# EAGLE design tinyfoc_triple (EAGLE 9.6.2)
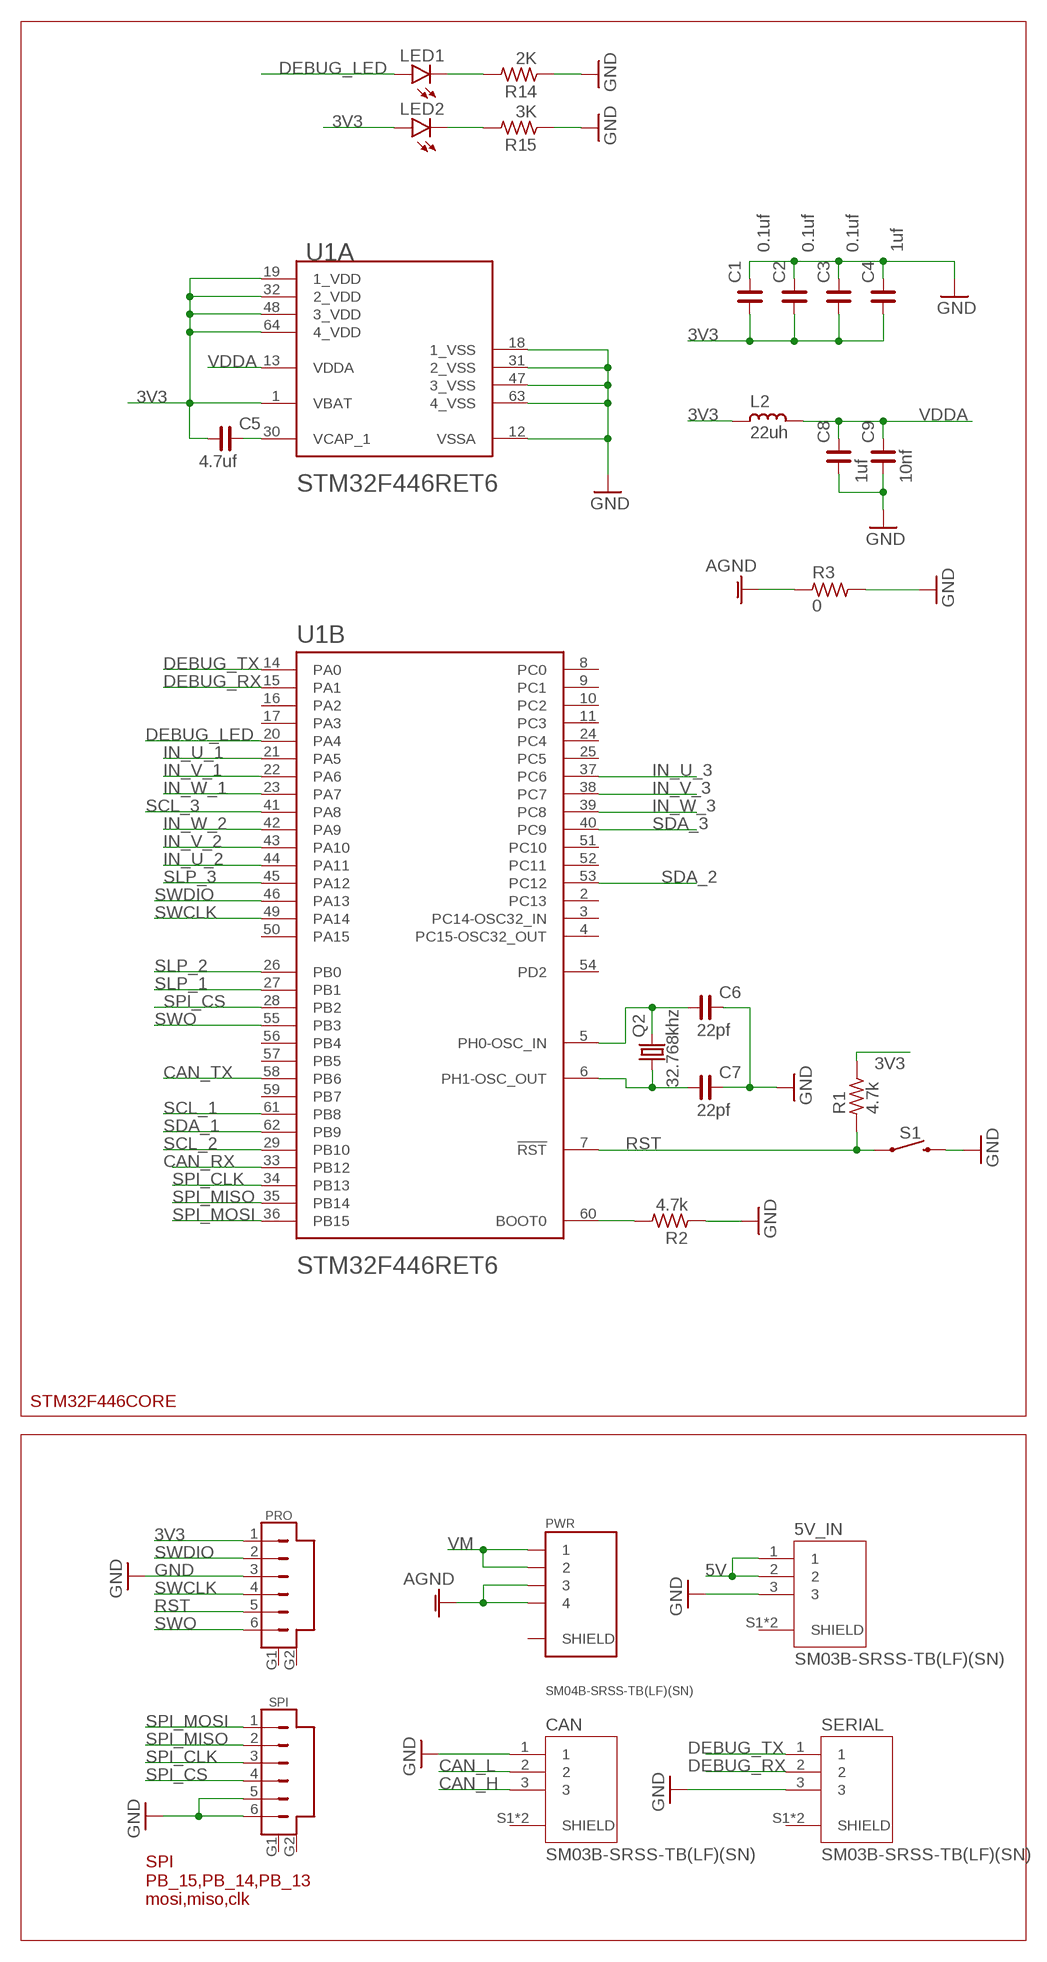
[diagram p0: schematic, sheet 1, part 1 of 2]
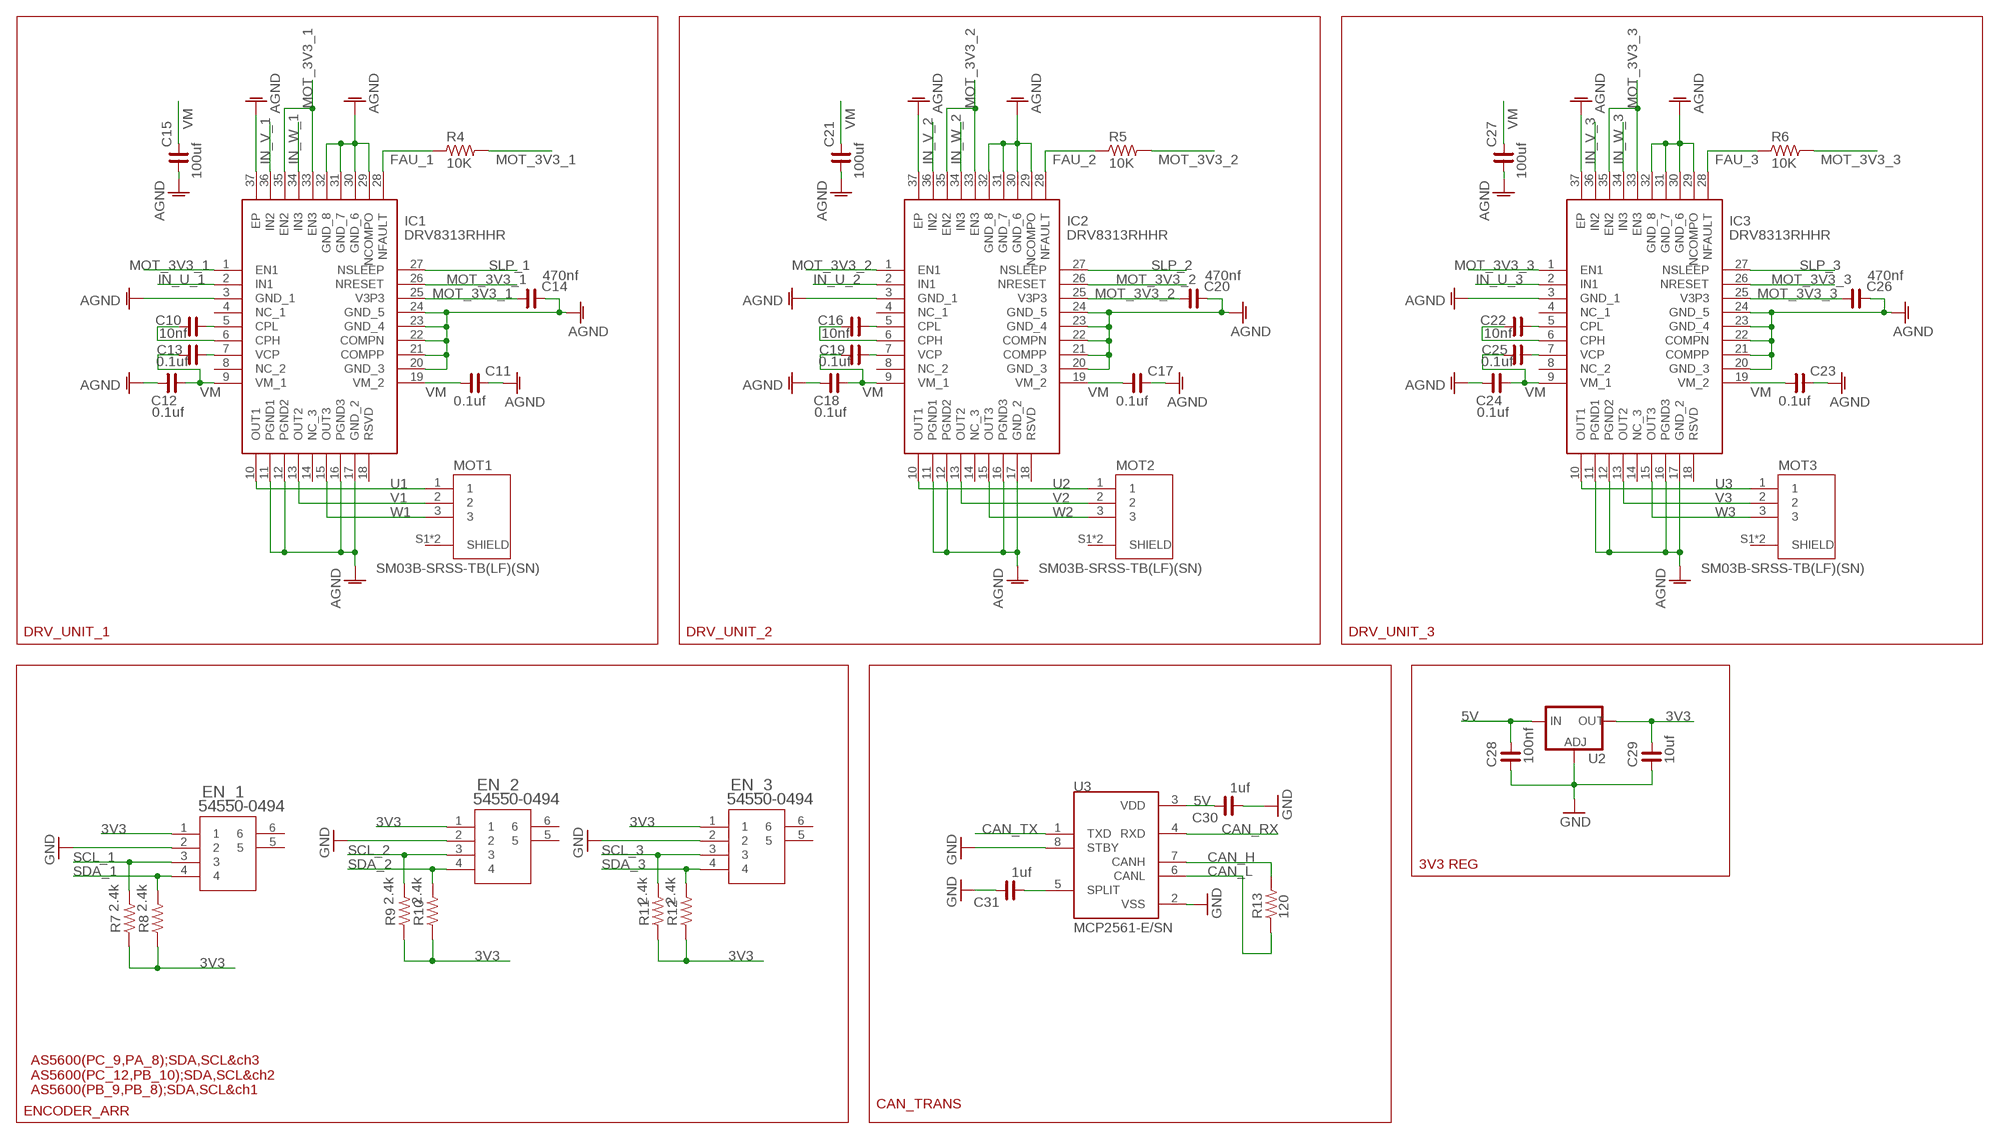
[diagram p1: schematic, sheet 1, part 2 of 2]

## Parts
5V_IN  SM03B-SRSS-TB(LF)(SN)  [JST_SM03B-SRSS-TB(LF)(SN)]
C1  0.1uf  C_0603  [C0603]
C2  0.1uf  C_0603  [C0603]
C3  0.1uf  C_0603  [C0603]
C4  1uf  C_0603  [C0603]
C5  4.7uf  C_1206  [C1206]
C6  22pf  C_0603  [C0603]
C7  22pf  C_0603  [C0603]
C8  1uf  C_0603  [C0603]
C9  10nf  C_0603  [C0603]
C10  10nf  C_0603  [C0603]
C11  0.1uf  C_0603  [C0603]
C12  0.1uf  C_0603  [C0603]
C13  0.1uf  C_0603  [C0603]
C14  470nf  C_0603  [C0603]
C15  100uf  C_1206  [C1206]
C16  10nf  C_0603  [C0603]
C17  0.1uf  C_0603  [C0603]
C18  0.1uf  C_0603  [C0603]
C19  0.1uf  C_0603  [C0603]
C20  470nf  C_0603  [C0603]
C21  100uf  C_1206  [C1206]
C22  10nf  C_0603  [C0603]
C23  0.1uf  C_0603  [C0603]
C24  0.1uf  C_0603  [C0603]
C25  0.1uf  C_0603  [C0603]
C26  470nf  C_0603  [C0603]
C27  100uf  C_1206  [C1206]
C28  100nf  C_0603  [C0603]
C29  10uf  C_0603  [C0603]
C30  1uf  C_0603  [C0603]
C31  1uf  C_0603  [C0603]
CAN  SM03B-SRSS-TB(LF)(SN)  [JST_SM03B-SRSS-TB(LF)(SN)]
EN_1  54550-0494  [CON4_1X4_DRB2_MOL]
EN_2  54550-0494  [CON4_1X4_DRB2_MOL]
EN_3  54550-0494  [CON4_1X4_DRB2_MOL]
IC1  DRV8313RHHR  [QFN50P600X600X100-37N]
IC2  DRV8313RHHR  [QFN50P600X600X100-37N]
IC3  DRV8313RHHR  [QFN50P600X600X100-37N]
L2  22uh  L_PM0603  [PM0603]
LED1  LEDCHIPLED_0603  [CHIPLED_0603]
LED2  LEDCHIPLED_0603  [CHIPLED_0603]
MOT1  SM03B-SRSS-TB(LF)(SN)  [JST_SM03B-SRSS-TB(LF)(SN)]
MOT2  SM03B-SRSS-TB(LF)(SN)  [JST_SM03B-SRSS-TB(LF)(SN)]
MOT3  SM03B-SRSS-TB(LF)(SN)  [JST_SM03B-SRSS-TB(LF)(SN)]
PRO  SM06B-SRSS-TB  [SM06B]
PWR  SM04B-SRSS-TB(LF)(SN)  [JST_SM04B-SRSS-TB(LF)(SN)]
Q2  32.768khz  KX-327-NHF  [3.2X1.5]
R1  4.7k  R_0603  [R0603]
R2  4.7k  R_0603  [R0603]
R3  0  R_0603  [R0603]
R4  10K  R_0603  [R0603]
R5  10K  R_0603  [R0603]
R6  10K  R_0603  [R0603]
R7  2.4k  R_0603  [R0603]
R8  2.4k  R_0603  [R0603]
R9  2.4k  R_0603  [R0603]
R10  2.4k  R_0603  [R0603]
R11  2.4k  R_0603  [R0603]
R12  2.4k  R_0603  [R0603]
R13  120  R_0603  [R0603]
R14  2K  R_0603  [R0603]
R15  3K  R_0603  [R0603]
S1  MOMENTARY-SWITCH-SPST-SMD-RIGHT-ANGLE  [TACTILE_SWITCH_SMD_RIGHT_ANGLE]
SERIAL  SM03B-SRSS-TB(LF)(SN)  [JST_SM03B-SRSS-TB(LF)(SN)]
SPI  SM06B-SRSS-TB  [SM06B]
U1  STMICROELECTRONICS_STM32F446RET6STMICROELECTRONICS_STM32F446RET6_0_0  [STMICROELECTRONICS_STM32F446RET6_0]
U2  V_REG_LM1117SOT223  [SOT223]
U3  MCP2561-E/SN  [SOIC127P600X175-8N]

## Nets
3V3: C1.1 C2.1 C3.1 C4.1 C5.1 C29.2 EN_1.1 EN_2.1 EN_3.1 L2.2 LED2.A PRO.1 R1.2 R7.1 R8.1 R9.1 R10.1 R11.1 R12.1 U1.1(A:VBAT) U1.19(A:1_VDD) U1.32(A:2_VDD) U1.48(A:3_VDD) U1.64(A:4_VDD) U2.2(OUT) U2.4(OUT)
5V: 5V_IN.1 5V_IN.2 C28.2 C30.2 U2.3(IN) U3.3(VDD)
AGND: C11.2 C12.1 C14.2 C15.1 C17.2 C18.1 C20.2 C21.1 C23.2 C24.1 C26.2 C27.1 IC1.3(GND_1) IC1.11(PGND1) IC1.12(PGND2) IC1.16(PGND3) IC1.17(GND_2) IC1.20(GND_3) IC1.21(COMPP) IC1.22(COMPN) IC1.23(GND_4) IC1.24(GND_5) IC1.29(NCOMPO) IC1.30(GND_6) IC1.31(GND_7) IC1.32(GND_8) IC1.37(EP) IC2.3(GND_1) IC2.11(PGND1) IC2.12(PGND2) IC2.16(PGND3) IC2.17(GND_2) IC2.20(GND_3) IC2.21(COMPP) IC2.22(COMPN) IC2.23(GND_4) IC2.24(GND_5) IC2.29(NCOMPO) IC2.30(GND_6) IC2.31(GND_7) IC2.32(GND_8) IC2.37(EP) IC3.3(GND_1) IC3.11(PGND1) IC3.12(PGND2) IC3.16(PGND3) IC3.17(GND_2) IC3.20(GND_3) IC3.21(COMPP) IC3.22(COMPN) IC3.23(GND_4) IC3.24(GND_5) IC3.29(NCOMPO) IC3.30(GND_6) IC3.31(GND_7) IC3.32(GND_8) IC3.37(EP) PWR.3 PWR.4 R3.1
CAN_H: CAN.3 R13.2 U3.7(CANH)
CAN_L: CAN.2 R13.1 U3.6(CANL)
CAN_RX: U1.33(B:PB12) U3.4(RXD)
CAN_TX: U1.58(B:PB6) U3.1(TXD)
DEBUG_LED: LED1.A U1.20(B:PA4)
DEBUG_RX: SERIAL.2 U1.15(B:PA1)
DEBUG_TX: SERIAL.1 U1.14(B:PA0)
FAU_1: IC1.28(NFAULT) R4.1
FAU_2: IC2.28(NFAULT) R5.1
FAU_3: IC3.28(NFAULT) R6.1
GND: 5V_IN.3 C1.2 C2.2 C3.2 C4.2 C6.2 C7.2 C8.1 C9.1 C28.1 C29.1 C30.1 C31.2 CAN.1 EN_1.2 EN_2.2 EN_3.2 PRO.3 R2.1 R3.2 R14.1 R15.1 S1.2 SERIAL.3 SPI.5 SPI.6 U1.12(A:VSSA) U1.18(A:1_VSS) U1.31(A:2_VSS) U1.47(A:3_VSS) U1.63(A:4_VSS) U2.1(ADJ) U3.2(VSS) U3.8(STBY)
IN_U_1: IC1.2(IN1) U1.21(B:PA5)
IN_U_2: IC2.2(IN1) U1.44(B:PA11)
IN_U_3: IC3.2(IN1) U1.37(B:PC6)
IN_V_1: IC1.36(IN2) U1.22(B:PA6)
IN_V_2: IC2.36(IN2) U1.43(B:PA10)
IN_V_3: IC3.36(IN2) U1.38(B:PC7)
IN_W_1: IC1.34(IN3) U1.23(B:PA7)
IN_W_2: IC2.34(IN3) U1.42(B:PA9)
IN_W_3: IC3.34(IN3) U1.39(B:PC8)
MOT_3V3_1: C14.1 IC1.1(EN1) IC1.25(V3P3) IC1.26(NRESET) IC1.33(EN3) IC1.35(EN2) R4.2
MOT_3V3_2: C20.1 IC2.1(EN1) IC2.25(V3P3) IC2.26(NRESET) IC2.33(EN3) IC2.35(EN2) R5.2
MOT_3V3_3: C26.1 IC3.1(EN1) IC3.25(V3P3) IC3.26(NRESET) IC3.33(EN3) IC3.35(EN2) R6.2
N$1: C5.2 U1.30(A:VCAP_1)
N$2: R2.2 U1.60(B:BOOT0)
N$3: C7.1 Q2.1 U1.6(B:PH1-OSC_OUT)
N$4: C10.2 IC1.5(CPL)
N$5: C6.1 Q2.2 U1.5(B:PH0-OSC_IN)
N$6: C10.1 IC1.6(CPH)
N$7: C13.2 IC1.7(VCP)
N$8: C16.2 IC2.5(CPL)
N$9: C16.1 IC2.6(CPH)
N$10: C19.2 IC2.7(VCP)
N$11: C22.2 IC3.5(CPL)
N$12: C22.1 IC3.6(CPH)
N$13: C25.2 IC3.7(VCP)
N$14: C31.1 U3.5(SPLIT)
N$15: LED2.C R15.2
N$16: LED1.C R14.2
RST: PRO.5 R1.1 S1.1 U1.7(B:!RST!)
SCL_1: EN_1.3 R7.2 U1.61(B:PB8)
SCL_2: EN_2.3 R9.2 U1.29(B:PB10)
SCL_3: EN_3.3 R11.2 U1.41(B:PA8)
SDA_1: EN_1.4 R8.2 U1.62(B:PB9)
SDA_2: EN_2.4 R10.2 U1.53(B:PC12)
SDA_3: EN_3.4 R12.2 U1.40(B:PC9)
SLP_1: IC1.27(NSLEEP) U1.27(B:PB1)
SLP_2: IC2.27(NSLEEP) U1.26(B:PB0)
SLP_3: IC3.27(NSLEEP) U1.45(B:PA12)
SPI_CLK: SPI.3 U1.34(B:PB13)
SPI_CS: SPI.4 U1.28(B:PB2)
SPI_MISO: SPI.2 U1.35(B:PB14)
SPI_MOSI: SPI.1 U1.36(B:PB15)
SWCLK: PRO.4 U1.49(B:PA14)
SWDIO: PRO.2 U1.46(B:PA13)
SWO: PRO.6 U1.55(B:PB3)
U1: IC1.10(OUT1) MOT1.1
U2: IC2.10(OUT1) MOT2.1
U3: IC3.10(OUT1) MOT3.1
V1: IC1.13(OUT2) MOT1.2
V2: IC2.13(OUT2) MOT2.2
V3: IC3.13(OUT2) MOT3.2
VDDA: C8.2 C9.2 L2.1 U1.13(A:VDDA)
VM: C11.1 C12.2 C13.1 C15.2 C17.1 C18.2 C19.1 C21.2 C23.1 C24.2 C25.1 C27.2 IC1.9(VM_1) IC1.19(VM_2) IC2.9(VM_1) IC2.19(VM_2) IC3.9(VM_1) IC3.19(VM_2) PWR.1 PWR.2
W1: IC1.15(OUT3) MOT1.3
W2: IC2.15(OUT3) MOT2.3
W3: IC3.15(OUT3) MOT3.3
Unconnected: 5V_IN.S1(SHIELD) 5V_IN.S2(SHIELD) CAN.S1(SHIELD) CAN.S2(SHIELD) EN_1.5 EN_1.6 EN_2.5 EN_2.6 EN_3.5 EN_3.6 IC1.4(NC_1) IC1.8(NC_2) IC1.14(NC_3) IC1.18(RSVD) IC2.4(NC_1) IC2.8(NC_2) IC2.14(NC_3) IC2.18(RSVD) IC3.4(NC_1) IC3.8(NC_2) IC3.14(NC_3) IC3.18(RSVD) MOT1.S1(SHIELD) MOT1.S2(SHIELD) MOT2.S1(SHIELD) MOT2.S2(SHIELD) MOT3.S1(SHIELD) MOT3.S2(SHIELD) PRO.G1 PRO.G2 PWR.S1(SHIELD) PWR.S2(SHIELD) SERIAL.S1(SHIELD) SERIAL.S2(SHIELD) SPI.G1 SPI.G2 U1.2(B:PC13) U1.3(B:PC14-OSC32_IN) U1.4(B:PC15-OSC32_OUT) U1.8(B:PC0) U1.9(B:PC1) U1.10(B:PC2) U1.11(B:PC3) U1.16(B:PA2) U1.17(B:PA3) U1.24(B:PC4) U1.25(B:PC5) U1.50(B:PA15) U1.51(B:PC10) U1.52(B:PC11) U1.54(B:PD2) U1.56(B:PB4) U1.57(B:PB5) U1.59(B:PB7)

## Notes on the sheet
- DRV_UNIT_1 | DRV_UNIT_2 | DRV_UNIT_3
- 3V3 REG
- AS5600(PC_9,PA_8);SDA,SCL&ch3
  AS5600(PC_12,PB_10);SDA,SCL&ch2
  AS5600(PB_9,PB_8);SDA,SCL&ch1
- CAN_TRANS
- STM32F446CORE | ENCODER_ARR
- SPI 
  PB_15,PB_14,PB_13
  mosi,miso,clk

## Library data of the parts
5V_IN CAN MOT1-MOT3 SERIAL = SM03B-SRSS-TB_LF__SN_:SM03B-SRSS-TB(LF)(SN): SH Series 3 Position 1 mm Pitch Surface Mount Side Entry Shrouded Header; AVAILABILITY: Unavailable; DESCRIPTION: Connector Header Surface Mount, Right Angle 3 position 0.039 _1.00mm_; MF: JST Sales; MP: SM03B-SRSS-TB_LF__SN_; PACKAGE: None; PRICE: None
C1-C31 = rc-master-smd:C_: NON-POLARIZED CAP
EN_1-EN_3 = fpc_4p_0.5:54550-0494; BUILT_BY: EMA_UL_Team; MANUFACTURER_PART_NUMBER: 54550-0494; SOURCELIBRARY: Molex_2010-01-01; VENDOR: Molex Connector Corporation
IC1-IC3 = DRV8313RHHR:DRV8313RHHR: TEXAS INSTRUMENTS - DRV8313RHHR - MOTOR DRIVER, 3P BLDC, 1.75A, VQFN-36 Source: Datasheet <http://www.ti.com/lit/ds/symlink/drv8313.pdf>; ARROW_PART_NUMBER: DRV8313RHHR; ARROW_PRICE-STOCK: https://www.arrow.com/en/products/drv8313rhhr/texas-instruments; DESCRIPTION: TEXAS INSTRUMENTS - DRV8313RHHR - MOTOR DRIVER, 3P BLDC, 1.75A, VQFN-36; HEIGHT: 1mm; MANUFACTURER_NAME: Texas Instruments; MANUFACTURER_PART_NUMBER: DRV8313RHHR; MOUSER_PART_NUMBER: 595-DRV8313RHHR; MOUSER_PRICE-STOCK: https://www.mouser.co.uk/ProductDetail/Texas-Instruments/DRV8313RHHR?qs=VymPLiRQZIS1rnepRn1%252BBA%3D%3D
L2 = rc-master-smd:L_: INDUCTOR
LED1 LED2 = led:LED: LED OSRAM: - CHIPLED LG R971, LG N971, LY N971, LG Q971, LY Q971, LO R971, LY R971 LH N974, LH R974 LS Q976, LO Q976, LY Q976 LO Q996 - Hyper CHIPLED LW Q18S LB Q993, LB Q99A, LB R99A - SideLED LS A670, LO A670, LY A670, LG A670, LP A670 LB A673, LV A673, LT A673, LW A673 LH A674 LY A675 LS A676, LA A676, LO A676, LY A676, LW A676 LS A679, LY A679, LG A679 - Hyper Micro SIDELED® LS Y876, LA Y876, LO Y876, LY Y876 LT Y87S - SmartLED LW L88C, LW L88S LB L89C, LB L89S, LG L890 LS L89K, LO L89K, LY L89K LS L896, LA L896, LO L896, LY L896 - TOPLED LS T670, LO T670, LY T670, LG T670, LP T670 LSG T670, LSP T670, LSY T670, LOP T670, LYG T670 LG T671, LOG T671, LSG T671 LB T673, LV T673, LT T673, LW T673 LH T674 LS T676, LA T676, LO T676, LY T676, LB T676, LH T676, LSB T676, LW T676 LB T67C, LV T67C, LT T67C, LS T67K, LO T67K, LY T67K, LW E67C LS E67B, LA E67B, LO E67B, LY E67B, LB E67C, LV E67C, LT E67C LW T67C LS T679, LY T679, LG T679 LS T770, LO T770, LY T770, LG T770, LP T770 LB T773, LV T773, LT T773, LW T773 LH T774 LS E675, LA E675, LY E675, LS T675 LS T776, LA T776, LO T776, LY T776, LB T776 LHGB T686 LT T68C, LB T68C - Hyper Mini TOPLED® LB M676 - Mini TOPLED Santana® LG M470 LS M47K, LO M47K, LY M47K Source: http://www.osram.convergy.de LUXEON: - LUMILED® LXK2-PW12-R00, LXK2-PW12-S00, LXK2-PW14-U00, LXK2-PW14-V00 LXK2-PM12-R00, LXK2-PM12-S00, LXK2-PM14-U00 LXK2-PE12-Q00, LXK2-PE12-R00, LXK2-PE12-S00, LXK2-PE14-T00, LXK2-PE14-U00 LXK2-PB12-K00, LXK2-PB12-L00, LXK2-PB12-M00, LXK2-PB14-N00, LXK2-PB14-P00, LXK2-PB14-Q00 LXK2-PR12-L00, LXK2-PR12-M00, LXK2-PR14-Q00, LXK2-PR14-R00 LXK2-PD12-Q00, LXK2-PD12-R00, LXK2-PD12-S00 LXK2-PH12-R00, LXK2-PH12-S00 LXK2-PL12-P00, LXK2-PL12-Q00, LXK2-PL12-R00 Source: www.luxeon.com KINGBRIGHT: KA-3528ASYC Source: www.kingbright.com
PRO SPI = SM06B-SRSS-TB:SM06B-SRSS-TB: CONN HEADER SH 6POS SIDE 1MM TIN Check prices <https://snapeda.com/parts/SM06B-SRSS-TB/JST%20Sales/view-part/?ref=eda>; AVAILABILITY: Bad; DESCRIPTION: Connector Header Surface Mount, Right Angle 6 position 0.039 (1.00mm); MF: JST Sales; MP: SM06B-SRSS-TB; PACKAGE: None; PRICE: None
PWR = SM04B-SRSS-TB_LF__SN_:SM04B-SRSS-TB(LF)(SN): SH Series 1.0 mm Pitch 2 Position Single Row Side Entry Shrouded Header Check prices <https://snapeda.com/parts/SM04B-SRSS-TB%28LF%29%28SN%29/JST%20Sales/view-part/?ref=eda>; ARROW_EUROPE-PURCHASE-URL: https://snapeda.com/shop?store=Arrow+Europe&id=557466; AVAILABILITY: Good; DESCRIPTION: Connector Header Surface Mount, Right Angle 4 position 0.039 (1.00mm); DIGIKEY-PURCHASE-URL: https://snapeda.com/shop?store=DigiKey&id=557466; MF: JST Sales; MP: SM04B-SRSS-TB(LF)(SN); PACKAGE: None; PRICE: None
Q2 = crystal-geyer_V1_0:KX-327: Tuning Fork Crystals (kHz) SMD: KX327 - Serie Model Size l/w/h [mm] Frequency Range Frequency Stability Temp. Range [°C] Load Capacitance AECQ 200 availabel Datasheet KX-327VT KX-327FT KX-327RT KX-327NHT KX-327NHF KX-327L KX-327S 1.25/1.05/0.5 1.6/1.0/0.5 2.0/1.2/0.6 3.2/1.5/0.8 3.2/1.5/0.8 7.0/1.5/1.4 8.2/3.8/2.5 32,768 kHz 32,768 kHz 32,768 kHz 32,768 kHz 32,768 kHz 32,768 kHz 32,768 kHz ±10 … ±20ppm ±10 … ±20ppm ±10 … ±20ppm ±10 … ±20ppm ±10 … ±20ppm ±10 … ±20ppm ±5 … ±20ppm (*) -40°C …+85°C (*) -40°C …+85°C (*) -40°C …+85°C (*) -40°C …+85°C (*) -40°C …+125°C (*) -40°C …+85°C (*) -40°C …+85°C 7/9/12,5 7/9/12,5 7/9/12,6 7/9/12,5 9/12,5 7/9/12,5 6/12,5 - - - - yes - - KX-327VT.pdf <http://www.geyer-electronic.de/uploads/tx_userartikelfrequenz/GEYER-KX-327VT.pdf> KX-327FT.pdf <http://www.geyer-electronic.de/uploads/tx_userartikelfrequenz/GEYER-KX-327FT.pdf> KX-327RT.pdf <http://www.geyer-electronic.de/uploads/tx_userartikelfrequenz/GEYER-KX-327RT.pdf> KX-327NHT.pdf <http://www.geyer-electronic.de/uploads/tx_userartikelfrequenz/GEYER-KX-327NHT.pdf> KX-327NHF.pdf <http://www.geyer-electronic.de/uploads/tx_userartikelfrequenz/GEYER-KX-327NHF.pdf> KX-327L.pdf <http://www.geyer-electronic.de/uploads/tx_userartikelfrequenz/GEYER-KX-327L.pdf> KX-327S.pdf <http://www.geyer-electronic.de/uploads/tx_userartikelfrequenz/GEYER-KX-327S.pdf> <http://www.geyer-electronic.de/fileadmin/template/img/logo-geyer-electronic.png> Details see: http://www.geyer-electronic.de/Frequenz-Produkte.9.0.html Created 2016-06-07, Hans Locher 2016 (C) Geyer Quartz Technology KX327VT,KX327FT,KX327RT,KX327NHT,KX327NHF,KX327S,KX327L;125105;1610;2012;3215;7015;8238;1,25x1,05,1.25x1.05;1,6x1,0,1.6x1.0;2,0x1,2,2.0x1.2;3,2x1,5,3.2x1.5;8,2x3,8,8.2x3.8,7.0x1.5,7,0x1,532.768kHz
R1-R15 = rc-master-smd:R_: RESISTOR
S1 = SparkFun-Switches:MOMENTARY-SWITCH-SPST: Momentary Switch (Pushbutton) - SPST Normally-open (NO) SPST momentary switches (buttons, pushbuttons). Variants PTH-12MM - 12mm square, through-hole Momentary Pushbutton Switch - 12mm Square <https://www.sparkfun.com/products/9190> (COM-09190) PTH-6.0MM, PTH-6.0MM-KIT - 6.0mm square, through-hole Mini Pushbutton Switch <https://www.sparkfun.com/products/97> (COM-00097) KIT package intended for soldering kit's - only one side of pads' copper is exposed. PTH-RIGHT-ANGLE-KIT - Right-angle, through-hole Right Angle Tactile Button <https://www.sparkfun.com/products/10791> - Used on SparkFun BigTime Watch Kit <https://www.sparkfun.com/products/11734> SMD-12MM - 12mm square, surface-mount Tactile Button - SMD (12mm) <https://www.sparkfun.com/products/12993> (COM-12993) Used on SparkFun PicoBoard <https://www.sparkfun.com/products/11888> SMD-4.5MM - 4.5mm Square Trackball Switch Used on SparkFun Blackberry Trackballer Breakout <https://www.sparkfun.com/products/13169> SMD-4.6MMX2.8MM - 4.60mm x 2.80mm, surface mount Used on SparkFun SAMD21 Mini Breakout <https://www.sparkfun.com/products/13664> SMD-5.2MM, SMD-5.2-REDUNDANT - 5.2mm square, surface-mount Mini Pushbutton Switch - SMD <https://www.sparkfun.com/products/8720> (COM-08720) Used on Arduino Pro Mini <https://www.sparkfun.com/products/11114> REDUNDANT package connects both switch circuits together SMD-6.0X3.5MM - 6.0 x 3.5mm, surface mount Momentary Reset Switch SMD <https://www.sparkfun.com/products/8229> (COM-08229) SMD-6.2MM-TALL - 6.2mm square, surface mount Tactile Button - SMD (6mm) <https://www.sparkfun.com/products/12992> Used on SparkFun Digital Sandbox <https://www.sparkfun.com/products/12651> SMD-RIGHT-ANGLE - Right-angle, surface mount Used on SparkFun Block for Intel® Edison - Arduino <https://www.sparkfun.com/products/13036>; PROD_ID: COMP-12265
U1 = STMicroelectronics - STM32F446RET6:STMICROELECTRONICS_STM32F446RET6: MCU 32-bit ARM Cortex M4 RISC 512KB Flash 2.5V/3.3V Medical 64-Pin LQFP Frame; AMBIENT_TEMPERATURE_RANGE_HIGH: +85°C; AMBIENT_TEMPERATURE_RANGE_LOW: -40°C; AUTOMOTIVE: No; CENTROID_NOT_SPECIFIED: No; CORE_ARCHITECTURE: ARM Cortex-M4; DATASHEET: https://www.st.com/resource/en/datasheet/stm32f446re.pdf; DATA_BUS_WIDTH: 32b; DEVICE_CLASS_L1: Integrated Circuits (ICs); DEVICE_CLASS_L2: Embedded Processors and Controllers; DEVICE_CLASS_L3: Microcontrollers; DIGIKEY_DESCRIPTION: IC MCU 32BIT 512KB FLASH 64LQFP; DIGIKEY_PART_NUMBER: 497-15376-ND; FOOTPRINT_PARAMETERS_1: {"fp_type":"MQFP","params":{"N1":{"nom":16,"long name":"Leads on long side","min":null,"max":null,"short name":"N1","type":"count"},"N2":{"nom":16,"long name":"Leads on wide side","min":null,"max":null,"short name":"N2","type":"count"},"A":{"nom":false,"long name":"Height","min":false,"max":1600000,"short name":"A","type":"measurement"},"A1":{"nom":false,"long name":"Package clearance","min":50000,"max":150000,"short name":"A1","type":"measurement"},"A2":{"nom":1400000,"long name":"Package height","min":1350000,"max":1450000,"short name":"A2","type":"measurement"},"D":{"nom":12000000,"long name":"Length /w leads","min":false,"max":false,"short name":"D","type":"measurement"},"D1":{"nom":10000000,"long name":"Package length","min":false,"max":false,"short name":"D1","type":"measurement"},"E":{"nom":12000000,"long name":"Width /w leads","min":false,"max":false,"short name":"E","type":"measurement"},"E1":{"nom":10000000,"long name":"Package width","min":false,"max":false,"short name":"E1","type":"measurement"},"B":{"nom":220000,"long name":"Lead width","min":170000,"max":270000,"short name":"B","type":"measurement"},"C":{"nom":false,"long name":"Lead thickness","min":90000,"max":200000,"short name":"C","type":"measurement"},"L":{"nom":600000,"long name":"Lead foot length","min":450000,"max":750000,"short name":"L","type":"measurement"},"e":{"nom":500000,"long name":"Lead pitch","min":null,"max":null,"short name":"e","type":"measurement"},"PHI":{"nom":false,"long name":"Lead angle","min":0,"max":70,"short name":"PHI","type":"measurement"},"HT":{"default":"No","long name":"Thermal pad","type":"multichoiceparent","short name":"HT","children":[]},"offset x":{"nom":0,"long name":"X Center offset","min":null,"max":null,"short name":"offset x","type":"measurement"},"offset y":{"nom":0,"long name":"Y Center offset","min":null,"max":null,"short name":"offset y","type":"measurement"},"LS":{"default":"Rounded rectangle","long name":"Land shape","type":"multichoice","short name":"LS"},"LS1":{"default":"Rectangle","long name":"Land shape (Pin 1)","type":"multichoice","short name":"LS1"},"solder toe":{"nom":550000,"long name":"Solder fillet (toe)","min":null,"max":null,"short name":"solder toe","type":"fixedmeasurement"},"solder heel":{"nom":450000,"long name":"Solder fillet (heel)","min":null,"max":null,"short name":"solder heel","type":"fixedmeasurement"},"solder side":{"nom":10000,"long name":"Solder fillet (side)","min":null,"max":null,"short name":"solder side","type":"fixedmeasurement"},"courtyard":{"nom":500000,"long name":"Courtyard","min":null,"max":null,"short name":"courtyard","type":"fixedmeasurement"},"SF":{"default":"A (<= 0.625mm pitch)","long name":"Packing level","type":"multichoiceparent","short name":"SF","help":"http://support.upverter.com/customer/portal/articles/978783-what-is-a-footprint-packing-level","children":["solder toe","solder heel","solder side","courtyard"]}}}; FOOTPRINT_PARAMETERS_2: {"fp_type":"MQFP","params":{"N1":{"nom":16,"long name":"Leads on long side","min":null,"max":null,"short name":"N1","type":"count"},"N2":{"nom":16,"long name":"Leads on wide side","min":null,"max":null,"short name":"N2","type":"count"},"A":{"nom":false,"long name":"Height","min":false,"max":1600000,"short name":"A","type":"measurement"},"A1":{"nom":false,"long name":"Package clearance","min":50000,"max":150000,"short name":"A1","type":"measurement"},"A2":{"nom":1400000,"long name":"Package height","min":1350000,"max":1450000,"short name":"A2","type":"measurement"},"D":{"nom":12000000,"long name":"Length /w leads","min":false,"max":false,"short name":"D","type":"measurement"},"D1":{"nom":10000000,"long name":"Package length","min":false,"max":false,"short name":"D1","type":"measurement"},"E":{"nom":12000000,"long name":"Width /w leads","min":false,"max":false,"short name":"E","type":"measurement"},"E1":{"nom":10000000,"long name":"Package width","min":false,"max":false,"short name":"E1","type":"measurement"},"B":{"nom":220000,"long name":"Lead width","min":170000,"max":270000,"short name":"B","type":"measurement"},"C":{"nom":false,"long name":"Lead thickness","min":90000,"max":200000,"short name":"C","type":"measurement"},"L":{"nom":600000,"long name":"Lead foot length","min":450000,"max":750000,"short name":"L","type":"measurement"},"e":{"nom":500000,"long name":"Lead pitch","min":null,"max":null,"short name":"e","type":"measurement"},"PHI":{"nom":false,"long name":"Lead angle","min":0,"max":70,"short name":"PHI","type":"measurement"},"HT":{"default":"No","long name":"Thermal pad","type":"multichoiceparent","short name":"HT","children":[]},"offset x":{"nom":0,"long name":"X Center offset","min":null,"max":null,"short name":"offset x","type":"measurement"},"offset y":{"nom":0,"long name":"Y Center offset","min":null,"max":null,"short name":"offset y","type":"measurement"},"LS":{"default":"Rounded rectangle","long name":"Land shape","type":"multichoice","short name":"LS"},"LS1":{"default":"Rectangle","long name":"Land shape (Pin 1)","type":"multichoice","short name":"LS1"},"solder toe":{"nom":350000,"long name":"Solder fillet (toe)","min":null,"max":null,"short name":"solder toe","type":"fixedmeasurement"},"solder heel":{"nom":350000,"long name":"Solder fillet (heel)","min":null,"max":null,"short name":"solder heel","type":"fixedmeasurement"},"solder side":{"nom":-20000,"long name":"Solder fillet (side)","min":null,"max":null,"short name":"solder side","type":"fixedmeasurement"},"courtyard":{"nom":250000,"long name":"Courtyard","min":null,"max":null,"short name":"courtyard","type":"fixedmeasurement"},"SF":{"default":"B (<= 0.625mm pitch)","long name":"Packing level","type":"multichoiceparent","short name":"SF","help":"http://support.upverter.com/customer/portal/articles/978783-what-is-a-footprint-packing-level","children":["solder toe","solder heel","solder side","courtyard"]}}}; FOOTPRINT_PARAMETERS_3: {"fp_type":"MQFP","params":{"N1":{"nom":16,"long name":"Leads on long side","min":null,"max":null,"short name":"N1","type":"count"},"N2":{"nom":16,"long name":"Leads on wide side","min":null,"max":null,"short name":"N2","type":"count"},"A":{"nom":false,"long name":"Height","min":false,"max":1600000,"short name":"A","type":"measurement"},"A1":{"nom":false,"long name":"Package clearance","min":50000,"max":150000,"short name":"A1","type":"measurement"},"A2":{"nom":1400000,"long name":"Package height","min":1350000,"max":1450000,"short name":"A2","type":"measurement"},"D":{"nom":12000000,"long name":"Length /w leads","min":false,"max":false,"short name":"D","type":"measurement"},"D1":{"nom":10000000,"long name":"Package length","min":false,"max":false,"short name":"D1","type":"measurement"},"E":{"nom":12000000,"long name":"Width /w leads","min":false,"max":false,"short name":"E","type":"measurement"},"E1":{"nom":10000000,"long name":"Package width","min":false,"max":false,"short name":"E1","type":"measurement"},"B":{"nom":220000,"long name":"Lead width","min":170000,"max":270000,"short name":"B","type":"measurement"},"C":{"nom":false,"long name":"Lead thickness","min":90000,"max":200000,"short name":"C","type":"measurement"},"L":{"nom":600000,"long name":"Lead foot length","min":450000,"max":750000,"short name":"L","type":"measurement"},"e":{"nom":500000,"long name":"Lead pitch","min":null,"max":null,"short name":"e","type":"measurement"},"PHI":{"nom":false,"long name":"Lead angle","min":0,"max":70,"short name":"PHI","type":"measurement"},"HT":{"default":"No","long name":"Thermal pad","type":"multichoiceparent","short name":"HT","children":[]},"offset x":{"nom":0,"long name":"X Center offset","min":null,"max":null,"short name":"offset x","type":"measurement"},"offset y":{"nom":0,"long name":"Y Center offset","min":null,"max":null,"short name":"offset y","type":"measurement"},"LS":{"default":"Rounded rectangle","long name":"Land shape","type":"multichoice","short name":"LS"},"LS1":{"default":"Rectangle","long name":"Land shape (Pin 1)","type":"multichoice","short name":"LS1"},"solder toe":{"nom":150000,"long name":"Solder fillet (toe)","min":null,"max":null,"short name":"solder toe","type":"fixedmeasurement"},"solder heel":{"nom":250000,"long name":"Solder fillet (heel)","min":null,"max":null,"short name":"solder heel","type":"fixedmeasurement"},"solder side":{"nom":-40000,"long name":"Solder fillet (side)","min":null,"max":null,"short name":"solder side","type":"fixedmeasurement"},"courtyard":{"nom":100000,"long name":"Courtyard","min":null,"max":null,"short name":"courtyard","type":"fixedmeasurement"},"SF":{"default":"C (<= 0.625mm pitch)","long name":"Packing level","type":"multichoiceparent","short name":"SF","help":"http://support.upverter.com/customer/portal/articles/978783-what-is-a-footprint-packing-level","children":["solder toe","solder heel","solder side","courtyard"]}}}; FOOTPRINT_VARIANT_NAME_0: Recommended_Land_Pattern; FOOTPRINT_VARIANT_NAME_1: IPC_A; FOOTPRINT_VARIANT_NAME_2: IPC_B; FOOTPRINT_VARIANT_NAME_3: IPC_C; FREQUENCY: 180MHz; HEIGHT: 1.6mm; INTERFACE: I2C,SPI,UART,USART,CAN,USB,LIN,IrDA,I2S,Other; LEAD_FREE: Yes; MAX_JUNCTION_TEMP: +125°C; MAX_SUPPLY_VOLTAGE: 3.6V; MEMORY_SIZE: 512KBytes; MEMORY_TYPE: FLASH; MF: STMicroelectronics; MFG_PACKAGE_IDENT: LQFP64-5W; MFG_PACKAGE_IDENT_COMPONENT_ID: ac0a92a8d775d0c0; MFG_PACKAGE_IDENT_DATE: 0; MFG_PACKAGE_IDENT_REV: 3; MIN_SUPPLY_VOLTAGE: 1.65V; MOUSER_DESCRIPTION: ARM Microcontrollers - MCU High-performance and DSP with FP, ARM Cortex-M4 MCU with 512 Kbytes Flash, 180 MHz CPU, Art Accelerator, SDRAM; MOUSER_PART_NUMBER: 511-STM32F446RET6; MPN: STM32F446RET6; NUMBER_OF_A/D_CONVERTERS: 3; NUMBER_OF_ADC_CHANNELS: 16; NUMBER_OF_CORES: 1; NUMBER_OF_I/OS: 50; NUMBER_OF_I2C_CHANNELS: 4; NUMBER_OF_PWM_CHANNELS: 25; NUMBER_OF_SPI_CHANNELS: 4; NUMBER_OF_TIMERS/COUNTERS: 14; NUMBER_OF_UART_CHANNELS: 6; NUMBER_OF_USB_CHANNELS: 2; PACKAGE: LQFP64; PREFIX: U; RAM_SIZE: 128KBytes; ROHS: Yes; STANDOFF_HEIGHT: 0.05mm; TEMPERATURE_RANGE_HIGH: +85°C; TEMPERATURE_RANGE_LOW: -40°C; VERIFICATION_VERSION: 0.0.0.3
U2 = SparkFun-IC-Power:V_REG_LM1117: Voltage Regulator LM1117 Standard adjustable voltage regulator but in SMD form. Spark Fun Electronics SKU : COM-00595; PROD_ID: VREG-08170
U3 = MCP2561-E_SN:MCP2561-E/SN: MCP2561 Series High-Speed 1 Mbps 5 V 5 uA CAN Transceiver - SOIC-8 Check prices <https://snapeda.com/parts/MCP2561-E/SN/Microchip/view-part/?ref=eda>; AVAILABILITY: Good; DESCRIPTION: 1/1 Transceiver Half CANbus 8-SOIC; DIGIKEY-PURCHASE-URL: https://snapeda.com/shop?store=DigiKey&id=46593; MF: Microchip; MOUSER-PURCHASE-URL: https://snapeda.com/shop?store=Mouser&id=46593; MP: MCP2561-E/SN; PACKAGE: SOIC-8 Microchip; PRICE: None

## Board
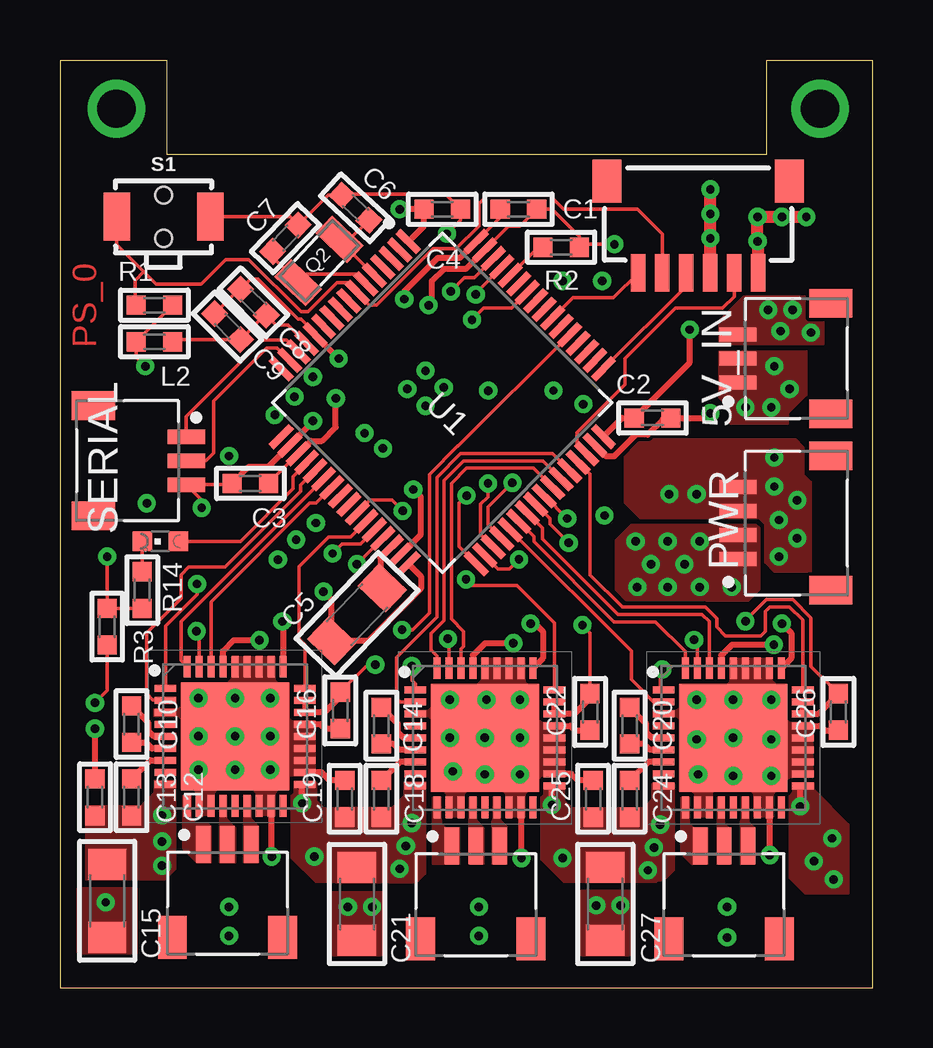
[diagram p2: board, top side]
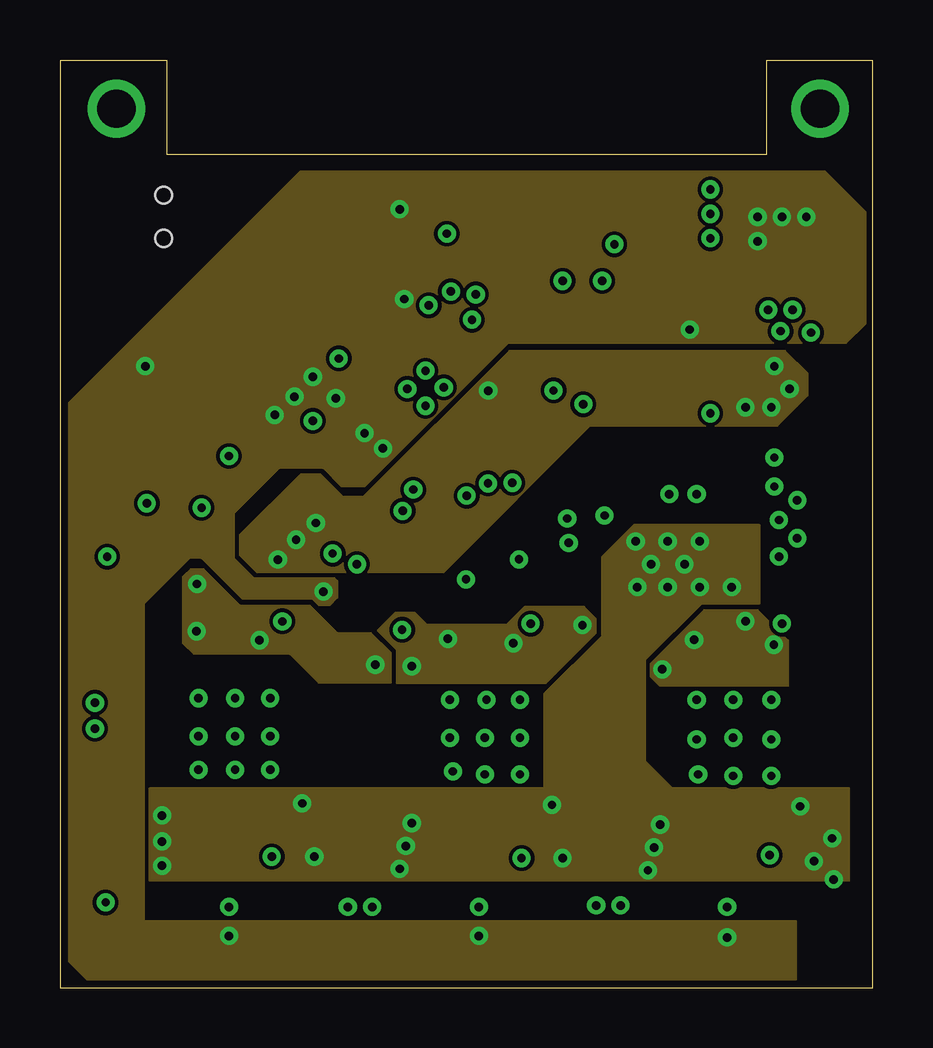
[diagram p3: board, inner layer Route2]
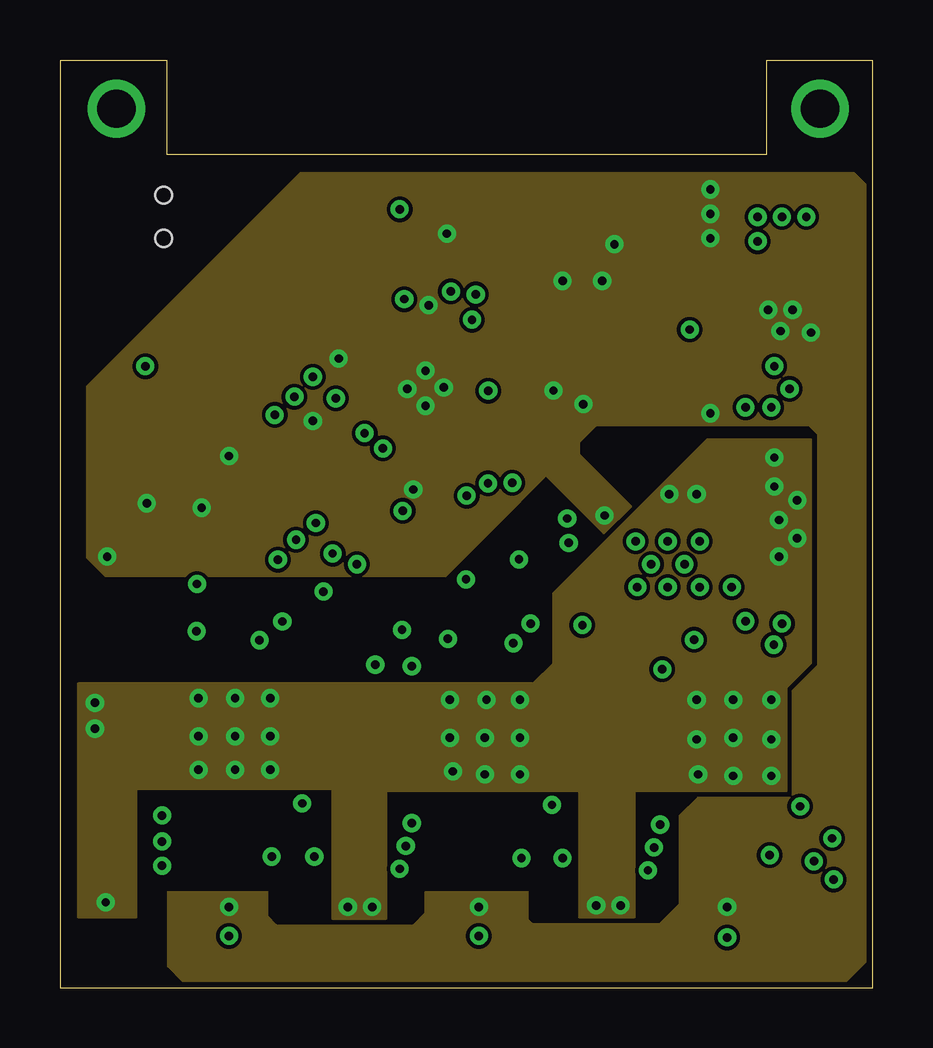
[diagram p4: board, inner layer Route15]
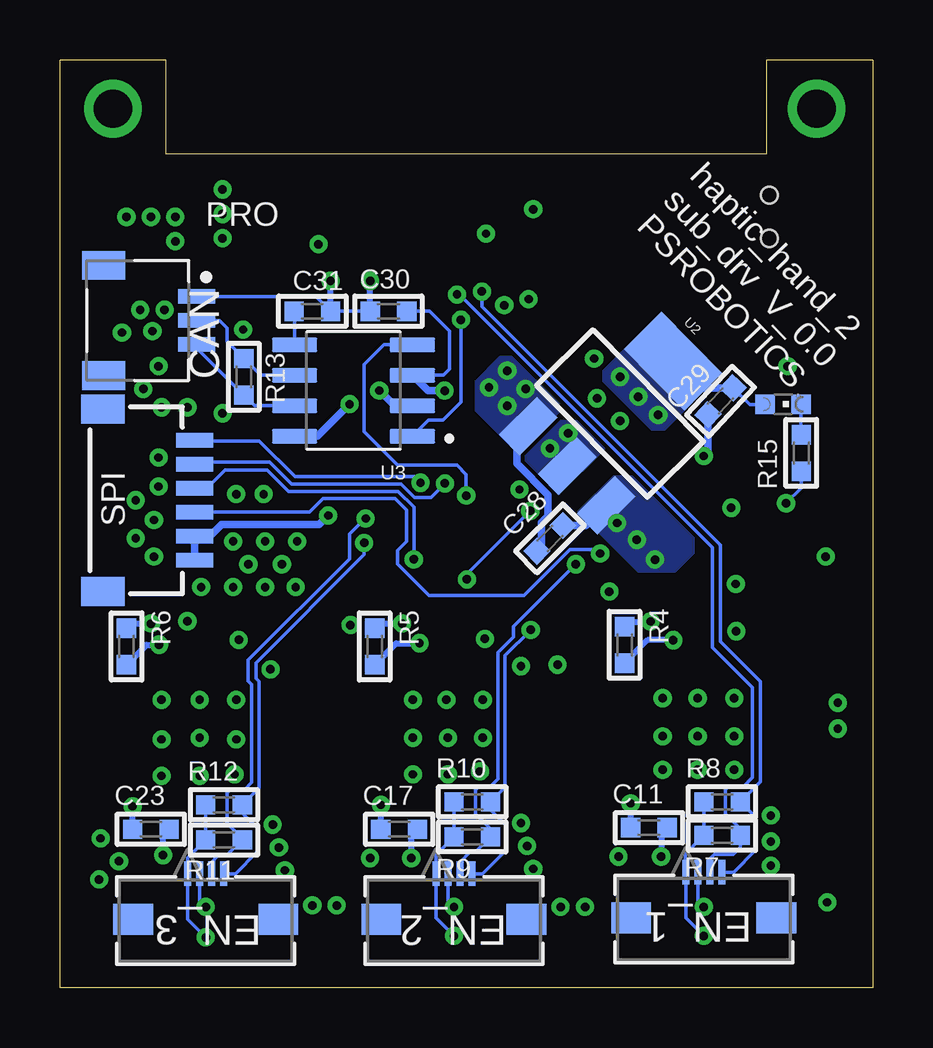
[diagram p5: board, bottom side, seen from below]

Size 33.89 x 38.67 mm. Coordinates in mm from the lower left corner, seen from the top.
Outline: 0,0 33.89,0 33.89,38.67 29.46,38.67 29.46,34.73 4.45,34.73 4.45,38.67 0,38.67 0,0
Copper layers (1+2*15+16): Top 0.035mm / dielectric 1.5mm / Route2 0.035mm / dielectric 0.15mm / Route15 0.035mm / dielectric 0.2mm / Bottom 0.035mm
Design rules "default *": minimum track width 6mil, minimum drill 0.35mm, track to track 6mil, track to pad 6mil, pad to pad 6mil, via to via 6mil, smd to smd 6mil, copper to edge 10mil, drill to drill 6mil, minimum pad ring 10mil, minimum via ring 8mil, stop-mask expansion 4mil, vias tented up to drill 0mil, thermal gap 10mil

### Footprints (pad centres in the part's own frame; a part is rotated, then mirrored left to right if it is on the bottom)
JST_SM03B-SRSS-TB(LF)(SN) = smd 0.6 x 1.55: 1 -1,0; 2 0,0; 3 1,0 | smd 1.2 x 1.8: S1 -2.3,-3.875; S2 2.3,-3.875
C0603 = smd 0.8 x 0.8: 1 -0.762,0; 2 0.762,0
C1206 = smd 1.3 x 1.6: 1 -1.524,0; 2 1.524,0
CON4_1X4_DRB2_MOL = smd 0.305 x 1.016: 1 0.75,-1.702; 2 0.25,-1.702; 3 -0.25,-1.702; 4 -0.75,-1.702 | smd 1.65 x 1.3: 5 -3.023,0.203; 6 3.023,0.203
QFN50P600X600X100-37N = smd 0.9 x 0.3: 1 -2.9,2; 2 -2.9,1.5; 3 -2.9,1; 4 -2.9,0.5; 5 -2.9,0; 6 -2.9,-0.5; 7 -2.9,-1; 8 -2.9,-1.5; 9 -2.9,-2; 19 2.9,-2; 20 2.9,-1.5; 21 2.9,-1; 22 2.9,-0.5; 23 2.9,0; 24 2.9,0.5; 25 2.9,1; 26 2.9,1.5; 27 2.9,2 | smd 0.3 x 0.9: 10 -2,-2.9; 11 -1.5,-2.9; 12 -1,-2.9; 13 -0.5,-2.9; 14 0,-2.9; 15 0.5,-2.9; 16 1,-2.9; 17 1.5,-2.9; 18 2,-2.9; 28 2,2.9; 29 1.5,2.9; 30 1,2.9; 31 0.5,2.9; 32 0,2.9; 33 -0.5,2.9; 34 -1,2.9; 35 -1.5,2.9; 36 -2,2.9 | smd 4.5 x 4.5: 37 0,0
PM0603 = smd 0.8 x 0.8: 1 -0.762,0; 2 0.762,0
CHIPLED_0603 = smd 0.8 x 0.8: A 0,-0.75; C 0,0.75
SM06B = smd 0.6 x 1.55: 1 -2.5,2.275; 2 -1.5,2.275; 3 -0.5,2.275; 4 0.5,2.275; 5 1.5,2.275; 6 2.5,2.275 | smd 1.2 x 1.8: G1 -3.8,-1.55; G2 3.8,-1.55
JST_SM04B-SRSS-TB(LF)(SN) = smd 0.6 x 1.55: 1 -1.5,0; 2 -0.5,0; 3 0.5,0; 4 1.5,0 | smd 1.2 x 1.8: S1 -2.8,-3.875; S2 2.8,-3.875
3.2X1.5 = smd 1 x 1.8: 1 -1.25,0; 2 1.25,0
R0603 = smd 0.8 x 0.8: 1 -0.762,0; 2 0.762,0
TACTILE_SWITCH_SMD_RIGHT_ANGLE = smd 1.1 x 2: 1 -1.95,0; 2 1.95,0 | hole 0.7: 0,0.9; 0,-0.9
STMICROELECTRONICS_STM32F446RET6_0 = smd 1.2 x 0.3: 1 -5.75,3.75; 2 -5.75,3.25; 3 -5.75,2.75; 4 -5.75,2.25; 5 -5.75,1.75; 6 -5.75,1.25; 7 -5.75,0.75; 8 -5.75,0.25; 9 -5.75,-0.25; 10 -5.75,-0.75; 11 -5.75,-1.25; 12 -5.75,-1.75; 13 -5.75,-2.25; 14 -5.75,-2.75; 15 -5.75,-3.25; 16 -5.75,-3.75; 33 5.75,-3.75; 34 5.75,-3.25; 35 5.75,-2.75; 36 5.75,-2.25; 37 5.75,-1.75; 38 5.75,-1.25; 39 5.75,-0.75; 40 5.75,-0.25; 41 5.75,0.25; 42 5.75,0.75; 43 5.75,1.25; 44 5.75,1.75; 45 5.75,2.25; 46 5.75,2.75; 47 5.75,3.25; 48 5.75,3.75 | smd 0.3 x 1.2: 17 -3.75,-5.75; 18 -3.25,-5.75; 19 -2.75,-5.75; 20 -2.25,-5.75; 21 -1.75,-5.75; 22 -1.25,-5.75; 23 -0.75,-5.75; 24 -0.25,-5.75; 25 0.25,-5.75; 26 0.75,-5.75; 27 1.25,-5.75; 28 1.75,-5.75; 29 2.25,-5.75; 30 2.75,-5.75; 31 3.25,-5.75; 32 3.75,-5.75; 49 3.75,5.75; 50 3.25,5.75; 51 2.75,5.75; 52 2.25,5.75; 53 1.75,5.75; 54 1.25,5.75; 55 0.75,5.75; 56 0.25,5.75; 57 -0.25,5.75; 58 -0.75,5.75; 59 -1.25,5.75; 60 -1.75,5.75; 61 -2.25,5.75; 62 -2.75,5.75; 63 -3.25,5.75; 64 -3.75,5.75
SOT223 = smd 1.219 x 2.235: 1 -2.311,-3.099; 2 0,-3.099; 3 2.311,-3.099 | smd 3.6 x 2.2: 4 0,3.099
SOIC127P600X175-8N = smd 1.9 x 0.6: 1 -2.455,1.905; 2 -2.455,0.635; 3 -2.455,-0.635; 4 -2.455,-1.905; 5 2.455,-1.905; 6 2.455,-0.635; 7 2.455,0.635; 8 2.455,1.905

### Placement (x,y rotation side)
5V_IN  28.26,26.23 90 top
C1  19.11,32.45 0 top
C2  24.7,23.75 0 top
C3  7.94,21.02 180 top
C4  15.94,32.45 0 top
C5  12.38,15.56 46.2 top
C6  12.32,32.51 137.1 top
C7  9.4,31.24 45.9 top
C8  8.06,28.57 315 top
C9  6.99,27.56 314.7 top
C10  2.98,10.99 90 top
C11  9.33,6.67 0 bottom
C12  1.46,7.94 270 top
C13  2.98,7.94 90 top
C14  11.68,11.56 270 top
C15  1.97,3.62 90 top
C16  13.4,10.92 90 top
C17  19.75,6.6 0 bottom
C18  11.87,7.87 270 top
C19  13.4,7.87 90 top
C20  22.1,11.49 270 top
C21  12.38,3.49 90 top
C22  23.75,10.92 90 top
C23  30.1,6.6 0 bottom
C24  22.23,7.87 270 top
C25  23.75,7.87 90 top
C26  32.45,11.49 270 top
C27  22.73,3.49 90 top
C28  13.46,18.73 45 bottom
C29  6.35,24.45 46.9 bottom
C30  20.19,28.19 0 bottom
C31  23.37,28.19 0 bottom
CAN  28.19,27.81 270 bottom
EN_1  7.05,3.11 180 bottom
EN_2  17.46,3.05 180 bottom
EN_3  27.81,3.05 180 bottom
IC1  7.3,10.48 0 top
IC2  17.72,10.41 0 top
IC3  28.07,10.41 0 top
L2  3.94,26.92 180 top
LED1  4.19,18.61 90 top
LED2  3.75,24.32 270 bottom
MOT1  6.99,5.97 0 top
MOT2  17.34,5.91 0 top
MOT3  27.69,5.91 0 top
PRO  26.61,32.07 180 top
PWR  28.26,19.37 90 top
Q2  10.79,30.29 46.3 top
R1  3.94,28.45 0 top
R2  20.89,30.86 180 top
R3  1.97,15.05 90 top
R4  10.35,14.29 270 bottom
R5  20.76,14.22 270 bottom
R6  31.11,14.22 270 bottom
R7  6.29,6.35 0 bottom
R8  6.29,7.75 0 bottom
R9  16.7,6.29 0 bottom
R10  16.7,7.75 0 bottom
R11  27.05,6.16 0 bottom
R12  27.05,7.62 0 bottom
R13  26.23,25.46 270 bottom
R14  3.43,16.57 90 top
R15  2.98,22.29 90 bottom
S1  4.32,32.13 0 top
SERIAL  5.27,21.97 270 top
SPI  30.54,20.32 270 bottom
U1  15.94,24.38 315 top
U2  10.54,23.94 314.7 bottom
U3  21.65,24.89 180 bottom

### Tracks (layer width: path | path; a pad name or v marks a point on that pad's centre or on a via)
3V3  (via drill 0.35)
  Top 0.152: R1.2 L2.2 3.17,26.29 v3.56,25.91 | U1.64 18.35,32.1 C1.1 | U1.19 8.7,21.03 C3.1
  Top 0.254: U1.32 15.05,17.14 15.05,16.64 12.87,14.46 C5.1 11.33,16.17 v10.99,16.51 | U1.48 23.43,23.75 C2.1 26.25,26.06 v26.25,27.43 | U1.1 15.18,31.75 C4.1 v14.16,32.45 | U1.64 16.67,30.42 15.75,30.42 14.35,29.02 v14.35,28.7 | U1.19 10.46,22.8 10.92,22.8 11.49,23.37 v11.49,24.56 v11.5,24.57
  Top 0.508: PRO.1 29.11,31.09 v29.08,31.11 v29.08,32.13 v30.1,32.13 v31.11,32.13
  Bottom 0.152: R8.1 R7.1 7.81,5.59 7.81,4.83 EN_1.1 7.8,2.91 v7.05,2.16 | R10.1 R9.1 18.21,5.54 EN_2.1 18.21,2.91 v17.46,2.16 | R12.1 R11.1 28.56,5.41 EN_3.1 28.56,2.85 v27.81,2.1 | LED2.A 4.51,24.3 5.13,24.3 C29.2
  Bottom 0.305: U2.4 7.23,25 C29.2
  other vias: 12.7,23.11 13.46,22.48 8.95,23.88 9.78,24.64 10.54,25.46
  pour Route2 (no thermals): 3.49,2.79 30.67,2.79 30.67,0.32 1.14,0.32 0.38,1.08 0.38,24.38 10.03,34.04 31.88,34.04 33.59,32.32 33.59,27.69 32.77,26.86 18.67,26.86 12.7,20.89 11.75,20.89 10.99,21.65 9.14,21.65 3.49,16
  pour Bottom (no thermals): 13.08,20.57 11.18,22.48 11.18,22.54 12.26,23.62 13.08,23.62 14.48,22.23 14.48,21.97
  pour Bottom (no thermals): 6.35,25.59 8.7,23.24 9.21,23.24 11.24,25.27 11.24,25.72 8.89,28.07 8.76,28.07 6.35,25.65
  pour Route2 (no thermals): 8.06,17.08 11.43,17.08 11.56,16.95 11.56,16.26 11.24,15.94 10.79,15.94 10.54,16.19 7.62,16.19 5.91,17.91 5.27,17.91 5.27,18.41 7.05,20.19 7.24,20.19 7.24,17.91
5V  (via drill 0.35)
  Bottom 0.152: U3.3 17.91,25.53 17.65,25.78 17.65,27.37 18.48,28.19 C30.2
  Bottom 0.305: U3.3 18.56,24.88 v17.85,24.88 | C28.2 11.96,19.27 U2.3
  other vias: 29.78,25.91 30.42,24.96 28.57,24.19 29.65,24.19 9.08,17.84 9.84,18.67 10.67,19.37
  pour Bottom (no thermals): 12.29,19.84 10.79,21.34 10.03,21.34 7.49,18.8 7.49,18.1 8.26,17.34 9.78,17.34
  pour Top (no thermals): 27.5,26.54 31.11,26.54 31.11,24.7 30.35,23.94 30.35,23.5 27.94,23.5 27.94,24.13 27.5,24.57
  pour Route2 (no thermals): 10.86,21.4 10.03,21.4 7.49,18.86 7.49,18.03 8.19,17.34 16,17.34 22.1,23.43 29.91,23.43 31.18,24.7 31.18,25.59 30.23,26.54 18.73,26.54 12.64,20.45 11.81,20.45
AGND  (via drill 0.35, 0.35 pad 0.7)
  Top 0.152: v1.46,11.87 1.97,12.38 R3.1
  Top 0.254: v8.83,5.46 8.83,7.55 IC1.17 | C14.2 11.05,10.79 10.87,10.98 IC1.24 | IC2.24 21.28,10.91 21.46,10.73 C20.2 | IC2.17 19.22,5.4 v19.24,5.4 | IC3.24 31.7,10.91 31.88,10.73 C26.2 | IC3.17 29.57,5.55 v29.59,5.52 | C18.1 11.24,8.64 10.9,8.98 IC1.20 | C24.1 21.59,8.64 21.31,8.91 IC2.20 | C12.1 v1.46,10.79
  Bottom 0.254: C11.2 8.83,6.41 v8.83,5.46 | v19.24,5.4 19.24,6.35 C17.2 | v29.59,5.52 29.59,6.35 C23.2
  other vias: 5.78,12.06 7.3,12.06 8.76,12.06 5.78,10.48 7.3,10.48 8.76,10.48 5.78,9.08 7.3,9.08 8.76,9.08 17.72,10.41 16.26,10.41 19.18,10.41 17.72,8.89 17.78,12 19.18,12 16.26,12 16.38,9.02 19.18,8.89 28.07,10.41 26.54,10.35 29.65,10.35 28.07,8.83 28.07,12 29.65,12 26.54,12 26.61,8.89 29.65,8.83 1.91,3.56 12,3.37 22.35,3.43 13.02,3.37 23.37,3.43 26.54,20.57 25.4,20.57 29.78,22.1 29.78,20.89 29.97,19.49 29.97,17.97 30.73,20.32 30.73,18.73
  pour Top (no thermals): 0.76,1.46 3.17,1.46 3.17,4.13 0.76,4.13
  pour Top (no thermals): 3.94,11.62 4.95,11.62 5.08,11.75 5.08,12.7 6.99,12.7 7.18,12.89 7.18,13.78 8.95,13.78 8.95,12.83 9.08,12.7 9.53,12.7 9.53,11.24 9.65,11.11 10.6,11.11 10.6,8.83 9.59,8.83 9.53,8.76 9.53,8.26 9.08,8.26 8.95,8.13 8.95,7.18 8.19,7.18 8.19,8.13 8.06,8.26 6.54,8.26 6.41,8.13 6.41,7.18 5.71,7.18 5.71,8.13 5.59,8.26 5.08,8.26 5.08,11.18 4.95,11.3 3.94,11.3
  pour Top (no thermals): 11.37,1.33 11.37,4 13.59,4 13.59,1.33
  pour Top (no thermals): 21.65,1.33 21.65,4.06 23.94,4.06 23.94,1.33
  pour Top (no thermals): 17.59,13.72 19.37,13.72 19.37,12.76 19.49,12.64 19.94,12.64 19.94,11.18 20.07,11.05 21.02,11.05 21.02,8.83 20.07,8.83 19.94,8.7 19.94,8.19 19.49,8.19 19.37,8.06 19.37,7.11 18.61,7.11 18.61,8.06 18.48,8.19 16.95,8.19 16.83,8.06 16.83,7.11 16.13,7.11 16.13,8.06 16,8.19 15.49,8.19 15.49,11.18 15.37,11.3 14.41,11.3 14.41,11.56 15.37,11.56 15.49,11.68 15.49,12.64 17.4,12.64 17.59,12.83
  pour Top (no thermals): 27.94,13.72 29.65,13.72 29.65,12.83 29.84,12.64 30.29,12.64 30.29,11.18 30.42,11.05 31.37,11.05 31.37,8.76 30.42,8.76 30.23,8.57 30.23,8.19 29.84,8.19 29.72,8.06 29.72,7.11 28.96,7.11 28.96,8.06 28.83,8.19 27.24,8.19 27.18,8.13 27.18,7.11 26.48,7.11 26.48,8.06 26.35,8.19 25.84,8.19 25.84,11.18 25.72,11.3 24.77,11.3 24.77,11.56 25.72,11.56 25.84,11.68 25.84,12.64 27.81,12.64 27.94,12.76
  pour Route15 (no thermals): 11.37,8.26 3.17,8.26 3.17,2.92 0.76,2.92 0.76,12.7 30.29,12.7 30.29,8.19 23.94,8.19 23.94,2.92 21.65,2.92 21.65,8.19 13.59,8.19 13.59,2.86 11.37,2.86
  pour Top (no thermals): 29.15,19.56 24.19,19.56 23.56,20.19 23.56,22.16 24.26,22.86 30.67,22.86 30.99,22.54 30.99,21.4 31.31,21.08 31.31,17.34 29.78,17.34 29.4,17.72 29.4,19.3
  pour Route15 (no thermals): 31.31,22.86 31.31,13.53 25.97,8.19 19.75,8.19 19.75,12.7 20.57,13.53 20.57,16.45 26.99,22.86
CAN_H
  Bottom 0.152: CAN.3 28.19,26.67 R13.2 25.78,24.26 U3.7
CAN_L
  Bottom 0.152: CAN.2 27.24,27.81 26.92,27.5 26.92,26.92 R13.1 25.53,25.53 U3.6
CAN_RX  (via drill 0.35)
  Top 0.152: v16.95,20.51 16.64,20.19 16.64,18.38 U1.33
  Bottom 0.152: U3.4 20.38,26.8 21.21,25.97 21.21,23.18 19.81,21.78 17.34,21.78 16.95,21.4 v16.95,20.51
CAN_TX  (via drill 0.35)
  Top 0.152: v17.18,27.84 17.65,28.32 18.82,28.32 U1.58
  Bottom 0.152: U3.1 18.52,23.66 17.93,23.66 17.18,24.41 v17.18,27.84
DEBUG_LED
  Top 0.152: U1.20 10.28,21.86 9.73,21.31 9.73,20.8 7.53,18.61 LED1.A
DEBUG_RX
  Top 0.152: SERIAL.2 6.1,21.97 6.41,22.29 6.41,24.46 8.62,26.67 9.06,26.67 U1.15
DEBUG_TX
  Top 0.152: U1.14 9.45,26.99 8.45,26.99 5.27,23.81 SERIAL.1
FAU_1  (via drill 0.35 pad 0.7)
  Top 0.254: v9.27,15.27 9.29,15.24 IC1.28
  Bottom 0.254: R4.1 10.16,15.24 9.3,15.24 v9.27,15.27
FAU_2  (via drill 0.35)
  Top 0.254: v19.62,15.18 19.81,15.18 20.13,14.86 20.13,13.73 IC2.28
  Bottom 0.254: R5.1 20.57,15.18 v19.62,15.18
FAU_3  (via drill 0.35)
  Top 0.254: v30.1,15.18 30.48,14.8 30.48,13.72 IC3.28
  Bottom 0.254: R6.1 30.92,15.18 v30.1,15.18
GND  (via drill 0.35)
  Top 0.152: U1.12 10.63,27.28 10.04,27.87 9.93,27.87 8.27,29.53 7.94,29.53 C8.1 7.46,29.11 C9.1 | U1.63 18.71,31.75 19.18,31.75 C1.2 20.51,32.45 21.65,31.3 R2.1 21.78,30.99 v23.11,30.99 | C2.2 25.4,23.69 25.13,23.69 | 9.57,22.59 U1.18 | C3.2 7.13,20.97 SERIAL.3 5.91,20.34 v5.91,20 | S1.2 9.59,32.13 C7.2 11.17,33.03 C6.2 11.81,33.08 16.07,33.08 C4.2 16.7,32 v16.13,31.43 | 10.54,23.58 v10.54,23.62 | v1.97,17.97 R3.2 R14.1 | v11.62,26.23 | 26.92,23.75 v27.11,23.94
  Top 0.254: 25.13,23.69 24.5,23.06 24.01,23.06 23.1,22.15 22.77,22.15 U1.47 | C3.2 7.87,21.72 8.7,21.72 9.57,22.59 | U1.18 10.54,23.58 | v14.73,20.77 15.05,20.45 15.05,18.9 U1.31 | U1.12 v11.62,26.23 | U1.63 16.92,29.96 16,29.96 15.49,29.45 15.49,28.57 v15.37,28.45 | C2.2 26.92,23.75
  Top 0.508: PRO.3 v27.11,31.23 v27.11,31.24 v27.11,32.26 v27.11,33.27
  Bottom 0.152: C30.1 C31.2 23.23,28.82 24.62,28.82 24.63,28.81 CAN.1 | EN_1.2 7.3,3.62 v7.05,3.37 | EN_2.2 17.71,3.62 v17.46,3.37 | EN_3.2 28.06,3.62 v27.81,3.37 | R15.1 2.98,20.83 v3.62,20.19
  Bottom 0.254: C31.2 v22.61,29.46 | C30.1 v20.95,29.46
  Bottom 0.305: U3.2 19.94,24.26 v20.57,24.89 | U3.8 23.15,22.99 v21.82,24.32 | SPI.6 SPI.5 28.25,18.83 27.62,18.83 27.15,19.3 23.08,19.3 v22.7,19.68 | C28.1 13.81,18.38 13.81,19.39 13.54,19.66 13.54,20.54 14.84,21.84 14.84,22.93 U2.1 | v7.05,22.16 6.87,22.34 C29.1
  other vias: 29.53,28.26 30.04,27.37 30.54,28.26 31.31,27.3 14.48,24.96 15.24,25.72 15.24,24.26 16,25.02
  pour Route15: 4.51,4 8.64,4 8.64,2.98 9.02,2.6 14.73,2.6 15.24,3.11 15.24,4 19.49,4 19.49,2.86 19.68,2.67 25.02,2.67 25.84,3.49 25.84,7.18 26.61,7.94 30.54,7.94 30.54,12.38 31.62,13.46 31.62,23.05 31.24,23.43 22.35,23.43 16.07,17.14 1.91,17.14 1.14,17.91 1.14,25.08 10.03,33.97 33.08,33.97 33.66,33.4 33.66,1.14 32.77,0.25 5.14,0.25 4.51,0.89
  pour Top (no thermals): 27.5,26.92 27.5,27.81 28.51,28.83 31.11,28.83 31.11,27.81 31.81,27.81 31.81,26.8 27.62,26.8
  pour Route15 (no thermals): 22.67,18.92 23.81,20.07 21.65,22.23 21.65,22.92 21.4,23.18 21.4,23.24 19.88,21.72
  pour Bottom (no thermals): 14.67,22.42 13.08,24 13.08,24.32 15.05,26.29 15.56,26.29 16.57,25.27 16.57,24.07 14.92,22.42
IN_U_1
  Top 0.152: IC1.2 4.38,12 3.87,12 3.62,12.26 3.62,14.8 5.04,16.22 5.04,17.21 5.37,17.53 6.88,17.53 10.03,20.68 10.03,20.95 U1.21
IN_U_2
  Top 0.152: IC2.2 14.18,11.91 14.03,12.06 14.03,13.77 15.71,15.44 15.71,21.27 16.7,22.26 20.53,22.26 U1.44
IN_U_3
  Top 0.152: IC3.2 24.75,11.91 23.81,12.85 23.81,14.04 U1.37
IN_V_1
  Top 0.152: IC1.36 5.05,13.63 5.05,15.26 U1.22
IN_V_2
  Top 0.152: IC2.36 15.72,13.82 15.46,14.08 15.46,14.76 16.02,15.32 16.02,21.14 16.83,21.96 20.13,21.96 U1.43
IN_V_3
  Top 0.152: IC3.36 26.07,14.01 24.83,15.25 23.09,15.25 19.75,18.59 19.75,18.8 U1.38
IN_W_1
  Top 0.152: IC1.34 6.3,16.08 10.41,20.19 10.69,20.19 U1.23
IN_W_2
  Top 0.152: U1.42 19.73,21.65 16.95,21.65 16.32,21.02 16.32,15.37 16.83,14.86 16.83,14.22 16.72,14.11 IC2.34
IN_W_3
  Top 0.152: IC3.34 27.07,15.26 26.77,15.56 23.26,15.56 20.11,18.71 20.11,19.15 U1.39
MOT_3V3_1  (via drill 0.35, 0.35 pad 0.7)
  Top 0.152: IC1.35 5.8,14.75 v5.7,14.86 | IC1.1 4.4,15.07 5.71,16.38 v5.71,16.83 | C14.1 12.83,13.46 v13.14,13.46
  Top 0.254: IC1.33 6.8,14.03 6.79,14.03 7.25,14.48 v8.32,14.48 | IC1.25 10.22,11.49 | 10.22,11.49 11.05,11.49 11.68,12.13 C14.1 | IC1.26 10.22,11.96 10.22,11.49
  Bottom 0.254: v8.32,14.48 9.39,14.48 R4.2
  pour Route2: 12.95,14.8 13.78,13.97 13.78,12.7 10.79,12.7 9.59,13.91 5.59,13.91 5.14,14.35 5.14,17.14 5.46,17.46 5.97,17.46 7.49,15.94 10.41,15.94 11.56,14.8
MOT_3V3_2  (via drill 0.35)
  Top 0.152: IC2.1 14.82,12.67 14.67,12.82 v14.67,13.4 | IC2.35 16.22,14.54 v16.17,14.54 | C20.1 22.1,14.8 v21.78,15.11
  Top 0.254: C20.1 22.1,12.06 21.46,11.43 20.63,11.43 IC2.25 IC2.26 | v18.9,14.36 17.72,14.36 17.22,13.85 IC2.33
  Bottom 0.254: R5.2 19.87,14.36 v18.9,14.36
  pour Route2: 13.24,14.89 14.03,14.1 14.03,12.7 20.26,12.7 22.35,14.8 22.35,15.37 21.84,15.88 19.37,15.88 18.61,15.11 15.3,15.11 14.8,15.62 13.97,15.62
MOT_3V3_3  (via drill 0.35)
  Top 0.152: IC3.1 25.04,12.54 25.04,13.2 v25.11,13.27 | 26.63,13.38 IC3.35 26.57,14.37 v26.44,14.5 | C26.1 31.3,13.4 31.3,15.42 30.54,16.18 29.45,16.18 28.57,15.3 v28.57,15.28
  Top 0.254: C26.1 31.61,11.41 IC3.25 IC3.26 | v29.76,14.29 28.01,14.29 27.57,13.85 IC3.33
  Bottom 0.254: R6.2 30.28,14.29 v29.76,14.29
  pour Route2: 24.64,13.53 26.86,15.75 29.08,15.75 30.35,14.48 30.35,12.57 25.02,12.57 24.64,12.95
N$1
  Top 0.254: C5.2 13.36,16.73 13.36,17.92 U1.30
N$2
  Top 0.152: U1.60 19.94,30.86 R2.2
N$3
  Top 0.152: U1.6 12.76,29.35 12.37,29.74 10.29,29.74 Q2.1 8.87,30.45 C7.1
N$4
  Top 0.254: C10.2 3.67,11.06 3.67,10.71 3.91,10.48 IC1.5
N$5
  Top 0.152: U1.5 11.66,31.14 Q2.2 12.08,31.19 C6.1
N$6
  Top 0.254: C10.1 3.59,10.22 3.84,9.97 IC1.6
N$7
  Top 0.254: C13.2 3.76,9.48 IC1.7
N$8
  Top 0.254: C16.2 14.09,10.99 14.09,10.65 14.32,10.41 IC2.5
N$9
  Top 0.254: IC2.6 14.15,9.91 13.91,10.16 C16.1
N$10
  Top 0.254: IC2.7 14.18,9.41 C19.2
N$11
  Top 0.254: C22.2 24.44,10.99 24.44,10.65 24.67,10.41 IC3.5
N$12
  Top 0.254: IC3.6 24.6,9.91 24.35,10.16 C22.1
N$13
  Top 0.254: IC3.7 24.53,9.41 C25.2
N$14
  Bottom 0.152: U3.5 24.11,28.17 C31.1
N$15
  Bottom 0.152: LED2.C 3,23.06 R15.2
N$16
  Top 0.152: LED1.C 3.43,18.59 R14.2
N$17  (via drill 1.6)
  other vias: 2.35,36.64
N$18  (via drill 1.6)
  other vias: 31.69,36.64
RST
  Top 0.152: S1.1 2.37,30.97 3.49,29.84 | 3.49,29.84 4,29.34 5.89,29.34 6.9,30.35 7.87,30.35 10.05,28.17 10.33,28.17 11.55,29.39 12.02,29.39 12.4,29 U1.7 12.4,28.94 12.89,28.45 13.21,28.45 15.56,30.8 16.51,30.8 17.46,31.75 17.46,32.68 17.86,33.08 20.37,33.08 21,32.45 24.07,32.45 25.11,31.41 PRO.5 | R1.1 3.13,28.49 3.13,29.48 3.49,29.84
SCL_1  (via drill 0.35)
  Top 0.152: v17.34,28.89 17.34,28.96 U1.61
  Bottom 0.152: v17.34,28.89 17.24,28.89 6.7,18.35 6.7,14.19 5.02,12.51 5.02,8.76 5.4,8.38 6.02,8.38 6.15,8.24 6.15,7.25 5.52,6.62 R7.2 5.52,5.84 5.82,5.55 6.61,5.55 6.81,5.35 EN_1.3
SCL_2  (via drill 0.35)
  Top 0.152: v12.38,17.65 U1.29
  Bottom 0.152: EN_2.3 17.22,5.22 16.77,5.68 16.55,5.68 R9.2 15.94,6.62 16.57,7.25 16.57,8.24 16.43,8.38 15.96,8.38 15.64,8.7 15.64,13.97 14.99,14.62 14.99,15.05 v12.38,17.65
SCL_3  (via drill 0.35)
  Top 0.152: v21.14,19.56 20.21,20.5 U1.41
  Bottom 0.152: EN_3.3 27.56,5.23 27.31,5.49 26.96,5.49 R11.2 26.29,6.22 26.92,6.85 26.92,8.12 26.78,8.25 26.2,8.25 25.9,8.55 25.9,12.64 26.04,12.78 26.04,13.65 21.82,17.87 21.82,18.92 21.18,19.56 v21.14,19.56
SDA_1  (via drill 0.35)
  Top 0.152: v16.3,29.02 16.87,29.59 17.27,29.59 U1.62
  Bottom 0.152: v16.3,29.02 16.3,28.38 6.36,18.45 6.36,14.43 4.7,12.76 4.7,8.57 R8.2 4.89,7.11 4.89,5.71 5.79,4.81 EN_1.4
SDA_2  (via drill 0.35)
  Top 0.152: v14.26,14.92 14.71,14.92 15.4,15.62 15.4,21.4 16.58,22.57 16.6,22.57 U1.53
  Bottom 0.152: v14.26,14.92 15.33,13.85 15.33,8.35 R10.2 15.94,7.41 15.31,6.78 15.31,5.72 15.3,5.71 16.27,4.75 EN_2.4
SDA_3  (via drill 0.35)
  Top 0.152: v21.21,18.54 20.42,19.33 20.42,19.56 19.85,20.14 U1.40
  Bottom 0.152: v21.21,18.54 21.21,18.05 25.72,13.54 25.72,12.89 25.59,12.76 25.59,8.32 R12.2 26.29,7.28 25.66,6.65 25.66,5.67 26.57,4.75 EN_3.4
SLP_1
  Top 0.152: U1.27 12.12,18.8 11.21,18.8 9.97,17.56 9.97,14.54 10.22,14.29 10.22,12.5 IC1.27
SLP_2  (via drill 0.35)
  Top 0.152: v14.29,19.88 13.84,20.32 12.94,20.32 U1.26 | v16.93,17.02 17.18,16.76 19.05,16.76 20.62,15.2 IC2.27
  Bottom 0.152: v14.29,19.88 16.93,17.24 v16.93,17.02
SLP_3
  Top 0.152: IC3.27 30.97,15.32 30.42,15.88 29.59,15.88 29.4,15.68 29.4,14.86 29.21,14.67 27.75,14.67 27.38,15.04 27.38,15.38 26.9,15.86 23.44,15.86 22.1,17.21 22.1,21.41 U1.45
SPI_CLK  (via drill 0.35)
  Top 0.152: U1.34 18.26,17.46 18.75,17.46 v19.14,17.85
  Bottom 0.152: v19.14,17.85 19.14,20.04 19.79,20.69 24.36,20.69 25.25,21.58 27,21.58 27.76,20.82 SPI.3
SPI_CS  (via drill 0.35)
  Top 0.152: U1.28 13.11,19.06 12.53,18.48 11.75,18.48 v11.37,18.1
  Bottom 0.152: SPI.4 23.49,19.82 22.92,20.39 19.92,20.39 19.44,19.91 19.44,18.59 19.81,18.22 19.81,17.67 18.5,16.36 14.54,16.36 12.63,18.26 11.53,18.26 v11.37,18.1
SPI_MISO  (via drill 0.35)
  Top 0.152: v17.84,21.02 17.84,20.46 17.54,20.16 17.54,18.89 U1.35
  Bottom 0.152: v17.84,21.02 18.42,20.44 19.11,20.44 19.67,21 24.23,21 25.15,21.91 28.18,21.91 SPI.2
SPI_MOSI  (via drill 0.35)
  Top 0.152: U1.36 17.84,19.3 17.84,20.03 v18.86,21.05
  Bottom 0.152: v18.86,21.05 19.11,21.3 24.09,21.3 25.59,22.8 28.25,22.8 SPI.1
SWCLK
  Top 0.152: PRO.4 26.11,29.25 U1.49
SWDIO
  Top 0.152: PRO.2 28.11,28.8 27.62,28.32 25.65,28.32 23.56,26.23 23.56,25.15 21.54,23.13 21.54,22.65 21.93,22.26 U1.46
SWO
  Top 0.152: PRO.6 23.08,28.77 21.38,28.77 U1.55
U1
  pour Top (no thermals): 5.14,8 5.46,8 5.46,7.05 5.65,6.86 6.16,6.86 6.29,6.73 6.29,5.21 5.71,5.21 5.14,5.78
U2
  pour Top (no thermals): 15.56,7.94 15.88,7.94 15.88,6.86 16.07,6.67 16.64,6.67 16.64,5.14 15.56,5.14
U3
  pour Top (no thermals): 25.91,7.94 26.23,7.94 26.23,6.86 26.42,6.67 26.99,6.67 26.99,5.14 26.35,5.14 25.91,5.59
V1
  pour Top (no thermals): 6.67,8 6.92,8 6.92,7.05 7.3,6.67 7.3,5.21 6.67,5.21
V2
  pour Top (no thermals): 17.08,7.94 17.34,7.94 17.34,6.99 17.65,6.67 17.65,5.14 17.08,5.14
V3
  pour Top (no thermals): 27.43,7.94 27.69,7.94 27.69,6.86 27.94,6.6 27.94,5.14 27.43,5.14
VDDA
  Top 0.152: U1.13 9.52,27.62 9.02,27.62 C8.2 8.54,28.04 C9.2 4.79,27.02 L2.1
VM  (via drill 0.35, 0.35 pad 0.7)
  Top 0.254: v10.1,7.68 10.1,8.37 IC1.19 | v20.51,7.62 20.51,8.31 IC2.19 | v30.86,7.56 30.86,8.31 IC3.19
  Bottom 0.254: C11.1 v10.1,7.68 | C17.1 v20.51,7.62 | C23.1 v30.86,7.56
  other vias: 4.25,7.18 4.25,6.1 4.25,5.08 10.6,5.46 14.67,6.86 14.41,5.91 14.16,4.95 20.95,5.4 25.02,6.79 24.77,5.84 24.51,4.89 32.19,6.22 31.43,5.27 32.26,4.51 24,18.61 25.34,18.61 24.64,17.65 26.04,17.65 25.34,16.7 26.67,16.7 24.07,16.7 26.67,18.61 28,16.7
  pour Top (no thermals): 4.83,8.64 3.94,8.64 3.94,8.13 3.37,7.56 1.08,7.56 1.08,4.51 4.38,4.51 4.83,4.95
  pour Top (no thermals): 11.49,7.49 11.49,4.38 14.86,4.38 15.24,4.76 15.24,8.57 14.35,8.57 14.35,8 13.84,7.49
  pour Top (no thermals): 24.7,8.51 25.59,8.51 25.59,4.89 25.15,4.45 24.89,4.45 24.83,4.38 21.84,4.38 21.84,7.49 24.32,7.49 24.7,7.87
  pour Top (no thermals): 9.78,8.57 10.67,8.57 10.67,7.81 10.99,7.49 11.56,7.49 11.56,4.38 10.67,4.38 9.65,5.4 9.65,8 9.78,8.13
  pour Top (no thermals): 20.19,8.51 21.02,8.51 21.02,7.81 21.34,7.49 21.91,7.49 21.91,4.38 21.02,4.38 20.07,5.33 20.07,7.94 20.19,8.06
  pour Top (no thermals): 30.54,8.51 30.54,8.13 30.42,8 30.42,4.57 31.05,3.94 32.89,3.94 32.89,6.79 31.43,8.26 31.43,8.51
  pour Route2 (no thermals): 3.75,8.32 32.89,8.32 32.89,4.45 3.75,4.45
  pour Route2: 20.19,12.26 22.61,14.67 22.61,17.97 23.94,19.3 29.15,19.3 29.15,16 26.73,16 24.38,13.65 24.38,9.46 25.72,8.13 25.72,7.56 25.65,7.49 20.83,7.49 20.19,8.13
  pour Top (no thermals): 29.15,19.18 29.15,16.57 28.7,16.13 23.62,16.13 23.18,16.57 23.18,18.67 23.81,19.3 29.02,19.3
W1
  pour Top (no thermals): 7.68,8 7.94,8 7.94,7.05 8.26,6.73 8.26,5.21 7.68,5.21
W2
  pour Top (no thermals): 18.03,7.94 18.35,7.94 18.35,6.99 18.61,6.73 18.61,5.14 18.03,5.14
W3
  pour Top (no thermals): 28.38,7.94 28.7,7.94 28.7,6.92 28.96,6.67 28.96,5.14 28.38,5.14

### Text on the board
Top: PS_0
bPlace: haptic_hand_2 / sub_drv V_0.0 / PSROBOTICS